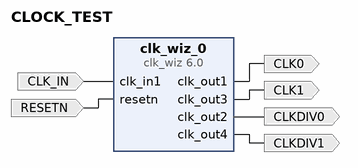
[diagram p0: block diagram of the top level]
# Vivado block design CLOCK_TEST, xc7z020clg400-1, Vivado 2019.1
create_bd_design CLOCK_TEST

create_bd_port -dir O CLK0
create_bd_port -dir O CLK1
create_bd_port -dir O CLKDIV0
create_bd_port -dir O CLKDIV1
create_bd_port -dir I CLK_IN
create_bd_port -dir I -type rst RESETN

create_bd_cell -type ip -vlnv xilinx.com:ip:clk_wiz:6.0 clk_wiz_0
set_property -dict [list \
  CONFIG.CLKOUT1_JITTER 97.841 \
  CONFIG.CLKOUT1_PHASE_ERROR 114.212 \
  CONFIG.CLKOUT1_REQUESTED_OUT_FREQ 800.000 \
  CONFIG.CLKOUT2_JITTER 126.455 \
  CONFIG.CLKOUT2_PHASE_ERROR 114.212 \
  CONFIG.CLKOUT2_REQUESTED_OUT_FREQ 200.000 \
  CONFIG.CLKOUT2_USED true \
  CONFIG.CLKOUT3_JITTER 97.841 \
  CONFIG.CLKOUT3_PHASE_ERROR 114.212 \
  CONFIG.CLKOUT3_REQUESTED_OUT_FREQ 800.000 \
  CONFIG.CLKOUT3_REQUESTED_PHASE 90.000 \
  CONFIG.CLKOUT3_USED true \
  CONFIG.CLKOUT4_JITTER 126.455 \
  CONFIG.CLKOUT4_PHASE_ERROR 114.212 \
  CONFIG.CLKOUT4_REQUESTED_OUT_FREQ 200.000 \
  CONFIG.CLKOUT4_REQUESTED_PHASE 22.5 \
  CONFIG.CLKOUT4_USED true \
  CONFIG.MMCM_CLKFBOUT_MULT_F 8.000 \
  CONFIG.MMCM_CLKOUT0_DIVIDE_F 1.000 \
  CONFIG.MMCM_CLKOUT1_DIVIDE 4 \
  CONFIG.MMCM_CLKOUT2_DIVIDE 1 \
  CONFIG.MMCM_CLKOUT2_PHASE 90.000 \
  CONFIG.MMCM_CLKOUT3_DIVIDE 4 \
  CONFIG.MMCM_CLKOUT3_PHASE 22.500 \
  CONFIG.NUM_OUT_CLKS 4 \
  CONFIG.PRIM_IN_FREQ 100.000 \
  CONFIG.RESET_PORT resetn \
  CONFIG.RESET_TYPE ACTIVE_LOW \
  CONFIG.USE_LOCKED false \
] [get_bd_cells clk_wiz_0]

# ---- connections ----

connect_bd_net [get_bd_pins clk_wiz_0/clk_out1] [get_bd_ports CLK0]
connect_bd_net [get_bd_pins clk_wiz_0/clk_out3] [get_bd_ports CLK1]
connect_bd_net [get_bd_pins clk_wiz_0/clk_out2] [get_bd_ports CLKDIV0]
connect_bd_net [get_bd_pins clk_wiz_0/clk_out4] [get_bd_ports CLKDIV1]
connect_bd_net [get_bd_ports CLK_IN] [get_bd_pins clk_wiz_0/clk_in1]
connect_bd_net [get_bd_ports RESETN] [get_bd_pins clk_wiz_0/resetn]

validate_bd_design
save_bd_design
